# Altium schematic sheet Sheet1_Overview.SchDoc: =ProjectName
size A4; DocumentNumber: 1; SheetNumber: 1; SheetTotal: 4
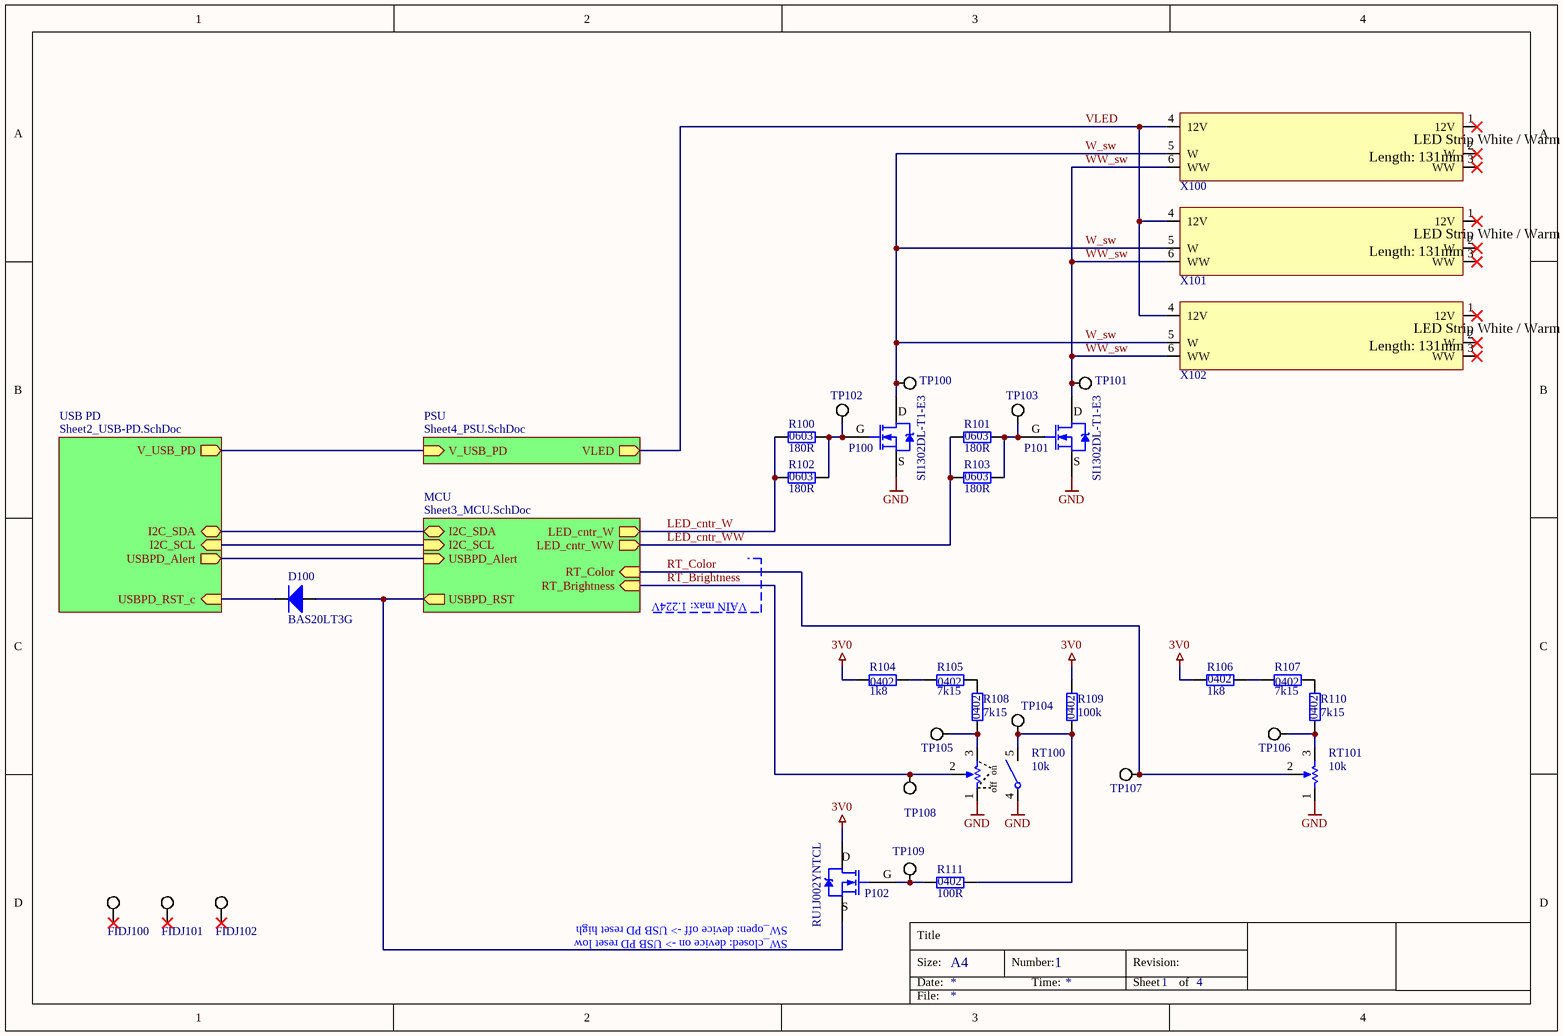
[diagram p0: Sheet1_Overview.SchDoc]

## Parts
D100  BAS20LT3G  [SOT-23-3]
FIDJ100  Fiducial  [FIDJ_1mm]  (value not drawn)  (net tie, no BOM)
FIDJ101  Fiducial  [FIDJ_1mm]  (value not drawn)  (net tie, no BOM)
FIDJ102  Fiducial  [FIDJ_1mm]  (value not drawn)  (net tie, no BOM)
P100  Manufacturer Part Number: SI1302DL-T1-E3  [SOT-323]  (hidden comment: P NMOS 30V 600mA)
P101  Manufacturer Part Number: SI1302DL-T1-E3  [SOT-323]  (hidden comment: P NMOS 30V 600mA)
P102  Manufacturer Part Number: RU1J002YNTCL  [UMT3F]  (hidden comment: P_NCH_50V_150mW)
R100  Resistance: 180R  Footprint: 0603  [R_0603]  (hidden comment: R 180R 0603)
R101  Resistance: 180R  Footprint: 0603  [R_0603]  (hidden comment: R 180R 0603)
R102  Resistance: 180R  Footprint: 0603  [R_0603]  (hidden comment: R 180R 0603)
R103  Resistance: 180R  Footprint: 0603  [R_0603]  (hidden comment: R 180R 0603)
R104  Resistance: 1k8  Footprint: 0402  [R_0402]  (hidden comment: R 1k8 0402)
R105  Resistance: 7k15  Footprint: 0402  [R_0402]  (hidden comment: R 7k15 0402)
R106  Resistance: 1k8  Footprint: 0402  [R_0402]  (hidden comment: R 1k8 0402)
R107  Resistance: 7k15  Footprint: 0402  [R_0402]  (hidden comment: R 7k15 0402)
R108  Resistance: 7k15  Footprint: 0402  [R_0402]  (hidden comment: R 7k15 0402)
R109  Resistance: 100k  Footprint: 0402  [R_0402]  (hidden comment: R 100k 0402)
R110  Resistance: 7k15  Footprint: 0402  [R_0402]  (hidden comment: R 7k15 0402)
R111  Resistance: 100R  Footprint: 0402  [R_0402]  (hidden comment: R 100R 0402)
RT100  10k  [RT_P091S-F*20]
RT101  10k  [RT_P091N-F*25]
TP100  TP  [TP_1mm]  (value not drawn)  (net tie, no BOM)
TP101  TP  [TP_1mm]  (value not drawn)  (net tie, no BOM)
TP102  TP  [TP_1mm]  (value not drawn)  (net tie, no BOM)
TP103  TP  [TP_1mm]  (value not drawn)  (net tie, no BOM)
TP104  TP  [TP_1mm]  (value not drawn)  (net tie, no BOM)
TP105  TP  [TP_1mm]  (value not drawn)  (net tie, no BOM)
TP106  TP  [TP_1mm]  (value not drawn)  (net tie, no BOM)
TP107  TP  [TP_1mm]  (value not drawn)  (net tie, no BOM)
TP108  TP  [TP_1mm]  (value not drawn)  (net tie, no BOM)
TP109  TP  [TP_1mm]  (value not drawn)  (net tie, no BOM)
X100  LED Strip  [LED_Strip_COB44-076]  (value not drawn)
X101  LED Strip  [LED_Strip_COB44-076]  (value not drawn)
X102  LED Strip  [LED_Strip_COB44-076]  (value not drawn)

## Sub-sheets
MCU = Sheet3_MCU.SchDoc: I2C_SCL (in), I2C_SDA (bidir), USBPD_Alert (in), USBPD_RST (out), LED_cntr_W (out), LED_cntr_WW (out), RT_Brightness (in), RT_Color (in)
PSU = Sheet4_PSU.SchDoc: V_USB_PD (in), VLED (out)
USB PD = Sheet2_USB-PD.SchDoc: USBPD_Alert (out), USBPD_RST_c (in), I2C_SDA (bidir), I2C_SCL (in), V_USB_PD (out)

## Nets
3V0: P102.3(D) R104.2 R106.1 R109.2
GND: P100.2(S) P101.2(S) RT100.1 RT100.4 RT101.1
LED_cntr_W: R100.1 R102.1 ; sheet MCU/LED_cntr_W
LED_cntr_WW: R101.1 R103.1 ; sheet MCU/LED_cntr_WW
RT_Brightness: RT100.2 TP108.1(TP) ; sheet MCU/RT_Brightness
RT_Color: RT101.2 TP107.1(TP) ; sheet MCU/RT_Color
VLED: X100.4(12V) X101.4(12V) X102.4(12V) ; sheet PSU/VLED
W_sw: P100.3(D) TP100.1(TP) X100.5(W) X101.5(W) X102.5(W)
WW_sw: P101.3(D) TP101.1(TP) X100.6(WW) X101.6(WW) X102.6(WW)
NetD100_1: D100.1(A) P102.2(S) ; sheet MCU/USBPD_RST
NetD100_3: D100.3(K) ; sheet USB PD/USBPD_RST_c
NetP100_1: P100.1(G) R100.2 R102.2 TP102.1(TP)
NetP101_1: P101.1(G) R101.2 R103.2 TP103.1(TP)
NetP102_1: P102.1(G) R111.1 TP109.1(TP)
NetR104_1: R104.1 R105.2
NetR105_1: R105.1 R108.2
NetR106_2: R106.2 R107.2
NetR107_1: R107.1 R110.2
NetR108_1: R108.1 RT100.3 TP105.1(TP)
NetR109_1: R109.1 R111.2 RT100.5 TP104.1(TP)
NetR110_1: R110.1 RT101.3 TP106.1(TP)
(unnamed): sheet USB PD/USBPD_Alert, sheet MCU/USBPD_Alert
(unnamed): sheet USB PD/I2C_SDA, sheet MCU/I2C_SDA
(unnamed): sheet USB PD/I2C_SCL, sheet MCU/I2C_SCL
(unnamed): sheet USB PD/V_USB_PD, sheet PSU/V_USB_PD

Not connected (* = marked no-connect by the designer): FIDJ100 1*; FIDJ101 1*; FIDJ102 1*; X100 1(12V)* 2(W)* 3(WW)*; X101 1(12V)* 2(W)* 3(WW)*; X102 1(12V)* 2(W)* 3(WW)*

## Notes on the sheet
- VAIN max: 1.224V
- SW_open: device off -> USB PD reset high
- SW_closed: device on -> USB PD reset low
- Title
- Size:
- Date:
- A4
- Number:
- Time:
- Revision:
- Sheet
- of
- File:
- (in symbol LED_Strip_2WH_131mm) LED Strip White / Warm White; Length: 131mm
- (in symbol RT_10k_SW_V) on; off

## Library data of the parts
D100 = D_LL_200V_200mA: DIODE GP 200V 200MA SOT23-3; Manufacturer: onsemi; Type: Diode; Supplier 1: Digi-Key; Supplier Part Number 1: BAS20LT3GOSCT-ND; Manufacturer Part Number: BAS20LT3G
FIDJ100-FIDJ102 = FIDJ_1mm: Fiducal 1mm
P100 P101 = P_NCH_30V_280mW: MOSFET N-CH 30V 600MA SC70-3; Manufacturer: Vishay Siliconix; Type: Transistor; Supplier 1: Digi-Key; Supplier Part Number 1: SI1302DL-T1-E3CT-ND
P102 = P_NCH_50V_150mW: MOSFET N-CH 50V 200MA UMT3F; Manufacturer: Rohm Semiconductor; Type: Transistor; Supplier 1: Digi-Key; Supplier Part Number 1: RU1J002YNTCLCT-ND
R100-R103 = R_180R_0603: RES 180 OHM 1% 1/10W 0603; Manufacturer: Stackpole Electronics Inc; Manufacturer Part Number: RMCF0603FT180R; Type: Resistor; Supplier 1: Digi-Key; Supplier Part Number 1: RMCF0603FT180RCT-ND
R104 R106 = R_1k8_0402: RES 1.8K OHM 1% 1/16W 0402; Manufacturer: Stackpole Electronics Inc; Manufacturer Part Number: RMCF0402FT1K80; Type: Resistor; Supplier 1: Digi-Key; Supplier Part Number 1: RMCF0402FT1K80CT-ND
R105 R107 R108 R110 = R_7k15_0402: RES 7.15K OHM 1% 1/16W 0402; Manufacturer: Stackpole Electronics Inc; Manufacturer Part Number: RMCF0402FT7K15; Type: Resistor; Supplier 1: Digi-Key; Supplier Part Number 1: RMCF0402FT7K15CT-ND
R109 = R_100k_0402: RES 100K OHM 5% 1/16W 0402; Manufacturer: YAGEO; Manufacturer Part Number: RC0402JR-07100KL; Type: Resistor; Supplier 1: Digi-Key; Supplier Part Number 1: 311-100KJRCT-ND
R111 = R_100R_0402: RES 100 OHM 1% 1/16W 0402; Manufacturer: Stackpole Electronics Inc; Manufacturer Part Number: RMCF0402FT100R; Type: Resistor; Supplier 1: Digi-Key; Supplier Part Number 1: RMCF0402FT100RCT-ND
RT100 = RT_10k_SW_V: POT 10K OHM 1/20W PLASTIC LINEAR; Manufacturer: TT Electronics/BI; Manufacturer Part Number: P091S-FC20BR10K; Type: other, Poti; Supplier 1: Digi-Key; Supplier Part Number 1: 987-1283-ND
RT101 = RT_10k_V: POT 10K OHM 1/20W PLASTIC LINEAR; Manufacturer: TT Electronics/BI; Manufacturer Part Number: P091N-FC25BR10K; Type: other, Poti; Supplier 1: Digi-Key; Supplier Part Number 1: 987-1279-ND
TP100-TP109 = TP_1mm: Test Point 1mm
X100-X102 = LED_Strip_2WH_131mm: revoART, 12V COB LED Streifen - einstellbare Farbtemperatur - alle 1,3cm teilbar - 10mm breit; Manufacturer Part Number: COB44-076; Supplier 1: LED24; Supplier Part Number 1: COB44-076; Type: other; Manufacturer: revoART